# EAGLE design R_pi_pcb (EAGLE 6.6.0)
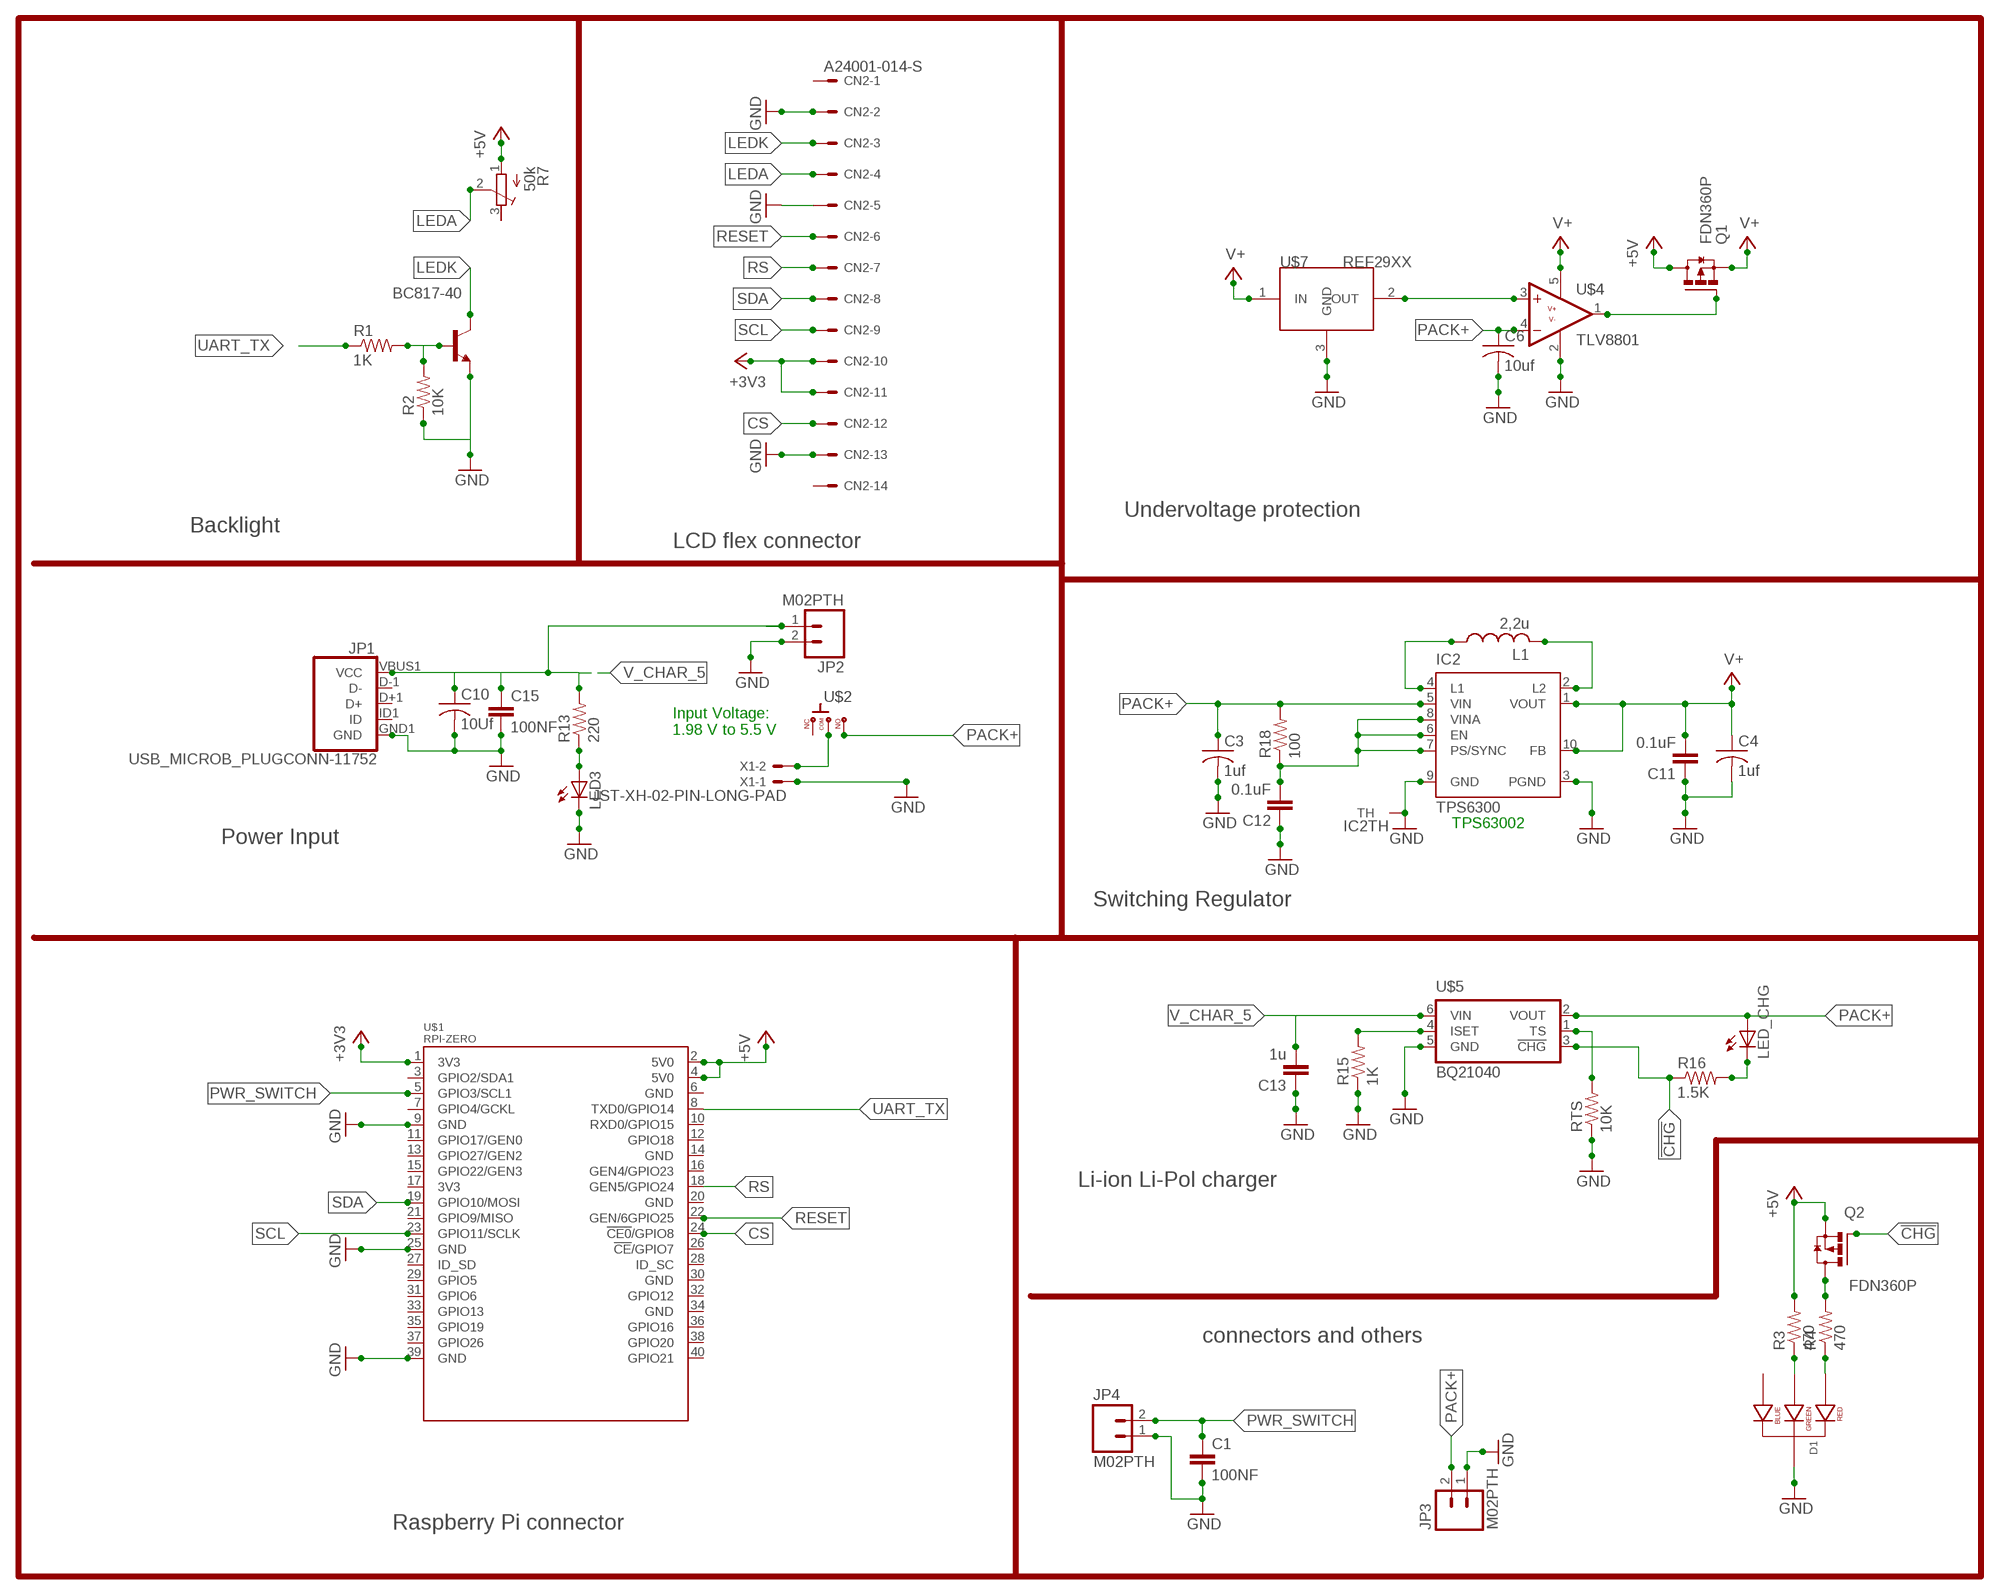
[diagram p0: schematic, sheet 1]

## Parts
BC817-40  BC817-40-NPN-SOT23-BEC  [SOT23-BEC]
C1  100NF  C-EUC0805  [C0805]
C3  1uf  C-USC1206K  [C1206K]
C4  1uf  C-USC1206K  [C1206K]
C6  10uf  C-USC1206K  [C1206K]
C10  10Uf  C-USC1206  [C1206]
C11  0.1uF  C-EUC0805  [C0805]
C12  0.1uF  C-EUC0805  [C0805]
C13  1u  C-EUC1206K  [C1206K]
C15  100NF  C-EUC0805  [C0805]
CN2  A24001-014-S  [A24001-014]
D1  LED-RGB-CC-THRUDIFFUSE  [LED-RGB-THRU]
IC2  TPS6300  [DRC-S-PVSON-N10]
JP1  USB_MICROB_PLUGCONN-11752  [USB-B-MICRO-SMD_V03]
JP2  M02PTH  [1X02]
JP3  M02PTH  [1X02]
JP4  M02PTH  [1X02]
L1  2,2u  L-USL1812  [L1812]
LED3  LEDCHIP-LED0805  [CHIP-LED0805]
LED_CHG  LEDCHIP-LED0805  [CHIP-LED0805]
Q1  FDN360P  [SUPER-SOT3]
Q2  FDN360P  [SUPER-SOT3]
R1  1K  R-US_R0805  [R0805]
R2  10K  R-US_R0805  [R0805]
R3  470  R-US_R0805  [R0805]
R4  470  R-US_R0805  [R0805]
R7  50k  R-TRIMM64P  [RTRIM64P]
R13  220  R-US_R0805  [R0805]
R15  1K  R-US_R0805  [R0805]
R16  1.5K  R-US_R0805  [R0805]
R18  100  R-US_R0805  [R0805]
RTS  10K  R-US_R0805  [R0805]
U$1  RPI-ZERO  [RASPBERRYPI_BASTELSTUBE_V13_RASPI_BOARD_B+_FULL]
U$2  -SWITCH  [CON3]
U$4  TLV8801  [SOT23-5]
U$5  BQ21040  [SOT23-6]
U$7  REF29XX  [SOT23]
X1  JST-XH-02-PIN-LONG-PAD  [JST-XH-02-PACKAGE-LONG-PAD]

## Nets
!CHG: Q2.1(G) R16.1 U$5.3(!CHG)
+3V3: CN2.10 CN2.11 U$1.1(3V3)
+5V: Q1.3(D) Q2.2(S) R3.2 R7.1(A) U$1.2(5V0) U$1.4(5V0)
CS: CN2.12 U$1.24(!CE0!/GPIO8)
GND: BC817-40.E C1.2 C3.2 C4.2 C6.2 C10.2 C11.1 C12.1 C13.1 C15.2 CN2.2 CN2.5 CN2.13 D1.2(CATHODE) IC2.3(PGND) IC2.9(GND) IC2.TH JP1.GND1(GND) JP2.2 JP3.1 JP4.1 LED3.C R2.1 R15.1 RTS.1 U$1.9(GND) U$1.25(GND) U$1.39(GND) U$4.2(V-) U$5.5(GND) U$7.3(GND) X1.1
LEDA: CN2.4 R7.2(S)
LEDK: BC817-40.C CN2.3
N$1: U$2.P$2 X1.2
N$3: U$4.3(+IN) U$7.2(OUT)
N$4: C12.2 IC2.6(EN) IC2.7(PS/SYNC) IC2.8(VINA) R18.1
N$5: Q1.1(G) U$4.1(OUT)
N$6: D1.3(GREEN_CATHODE) R3.1
N$7: BC817-40.B R1.2 R2.2
N$8: D1.1(RED_CATHODE) R4.1
N$10: Q2.3(D) R4.2
N$14: IC2.4(L1) L1.1
N$19: LED3.A R13.1
N$20: IC2.2(L2) L1.2
N$24: R15.2 U$5.4(ISET)
N$25: RTS.2 U$5.1(TS)
N$27: LED_CHG.C R16.2
PACK+: C3.1 C6.1 IC2.5(VIN) JP3.2 LED_CHG.A R18.2 U$2.P$3 U$4.4(-IN) U$5.2(VOUT)
PWR_SWITCH: C1.1 JP4.2 U$1.5(GPIO3/SCL1)
RESET: CN2.6 U$1.22(GEN/6GPIO25)
RS: CN2.7 U$1.18(GEN5/GPIO24)
SCL: CN2.9 U$1.23(GPIO11/SCLK)
SDA: CN2.8 U$1.19(GPIO10/MOSI)
UART_TX: R1.1 U$1.8(TXD0/GPIO14)
V+: C4.1 C11.2 IC2.1(VOUT) IC2.10(FB) Q1.2(S) U$4.5(V+) U$7.1(IN)
V_CHAR_5: C10.1 C13.2 C15.1 JP1.VBUS1(VCC) JP2.1 R13.2 U$5.6(VIN)
Unconnected: CN2.1 CN2.14 D1.4(BLUE_CATHODE) JP1.D+1(D+) JP1.D-1(D-) JP1.ID1(ID) R7.3(E) U$1.3(GPIO2/SDA1) U$1.6(GND) U$1.7(GPIO4/GCKL) U$1.10(RXD0/GPIO15) U$1.11(GPIO17/GEN0) U$1.12(GPIO18) U$1.13(GPIO27/GEN2) U$1.14(GND) U$1.15(GPIO22/GEN3) U$1.16(GEN4/GPIO23) U$1.17(3V3) U$1.20(GND) U$1.21(GPIO9/MISO) U$1.26(!CE!/GPIO7) U$1.27(ID_SD) U$1.28(ID_SC) U$1.29(GPIO5) U$1.30(GND) U$1.31(GPIO6) U$1.32(GPIO12) U$1.33(GPIO13) U$1.34(GND) U$1.35(GPIO19) U$1.36(GPIO16) U$1.37(GPIO26) U$1.38(GPIO20) U$1.40(GPIO21) U$2.P$1

## Notes on the sheet
- Undervoltage protection
- Backlight
- LCD flex connector
- Input Voltage:
  1.98 V to 5.5 V
- TPS63002
- Power Input
- Switching Regulator
- Li-ion Li-Pol charger
- connectors and others
- Raspberry Pi connector

## Library data of the parts
BC817-40 = transistor:*-NPN-: NPN Transistror BF959 corrected 2008.03.06
C1 C11-C13 C15 = rcl:C-EU: CAPACITOR, European symbol
C3 C4 C6 C10 = rcl:C-US: CAPACITOR, American symbol
CN2 = con-omnetics:A24001-014-S: CONNECTOR wire to board 1.27 mm (0.05") pitch header
D1 = SparkFun-LED:LED-RGB-CC-THRU: RGB Through-hole common cathode LED SparkFun Storefront: COM-00105 (Clear) COM-09264 (Diffuse); PROD_ID: DIO-09434
IC2 = texas_1:TPS6300*: HIGH EFFICIENT SINGLE INDUCTOR BUCK-BOOST CONVERTER WITH 1.8-A SWITCHES Source: http://focus.ti.com/lit/ds/symlink/tps63001.pdf; MPN: TPS63000DRCTG4; OC_FARNELL: 1511852; OC_NEWARK: 59M7217
JP1 = SparkFun-Connectors:USB_MICROB_PLUG: USB Micro-B Plug Comes in a variety of packages. Check out Hirose's ZX-x0 line: http://www.hirose.co.jp/cataloge_hp/e24200011.pdf; PROD_ID: CONN-11752
JP2-JP4 = SparkFun-Connectors:M02: Standard 2-pin 0.1" header. Use with - straight break away headers ( PRT-00116) - right angle break away headers (PRT-00553) - swiss pins (PRT-00743) - machine pins (PRT-00117) - female headers (PRT-00115) Molex polarized connector foot print use with: PRT-08233 with associated crimp pins and housings. 2.54_SCREWTERM for use with PRT-10571. 3.5mm Screw Terminal footprints for PRT-08084 5mm Screw Terminal footprints for use with PRT-08433
L1 = rcl:L-US: INDUCTOR, American symbol
LED3 LED_CHG = led:LED: LED OSRAM: - CHIPLED LG R971, LG N971, LY N971, LG Q971, LY Q971, LO R971, LY R971 LH N974, LH R974 LS Q976, LO Q976, LY Q976 LO Q996 - Hyper CHIPLED LW Q18S LB Q993, LB Q99A, LB R99A - SideLED LS A670, LO A670, LY A670, LG A670, LP A670 LB A673, LV A673, LT A673, LW A673 LH A674 LY A675 LS A676, LA A676, LO A676, LY A676, LW A676 LS A679, LY A679, LG A679 - Hyper Micro SIDELED® LS Y876, LA Y876, LO Y876, LY Y876 LT Y87S - SmartLED LW L88C, LW L88S LB L89C, LB L89S, LG L890 LS L89K, LO L89K, LY L89K LS L896, LA L896, LO L896, LY L896 - TOPLED LS T670, LO T670, LY T670, LG T670, LP T670 LSG T670, LSP T670, LSY T670, LOP T670, LYG T670 LG T671, LOG T671, LSG T671 LB T673, LV T673, LT T673, LW T673 LH T674 LS T676, LA T676, LO T676, LY T676, LB T676, LH T676, LSB T676, LW T676 LB T67C, LV T67C, LT T67C, LS T67K, LO T67K, LY T67K, LW E67C LS E67B, LA E67B, LO E67B, LY E67B, LB E67C, LV E67C, LT E67C LW T67C LS T679, LY T679, LG T679 LS T770, LO T770, LY T770, LG T770, LP T770 LB T773, LV T773, LT T773, LW T773 LH T774 LS E675, LA E675, LY E675, LS T675 LS T776, LA T776, LO T776, LY T776, LB T776 LHGB T686 LT T68C, LB T68C - Hyper Mini TOPLED® LB M676 - Mini TOPLED Santana® LG M470 LS M47K, LO M47K, LY M47K Source: http://www.osram.convergy.de LUXEON: - LUMILED® LXK2-PW12-R00, LXK2-PW12-S00, LXK2-PW14-U00, LXK2-PW14-V00 LXK2-PM12-R00, LXK2-PM12-S00, LXK2-PM14-U00 LXK2-PE12-Q00, LXK2-PE12-R00, LXK2-PE12-S00, LXK2-PE14-T00, LXK2-PE14-U00 LXK2-PB12-K00, LXK2-PB12-L00, LXK2-PB12-M00, LXK2-PB14-N00, LXK2-PB14-P00, LXK2-PB14-Q00 LXK2-PR12-L00, LXK2-PR12-M00, LXK2-PR14-Q00, LXK2-PR14-R00 LXK2-PD12-Q00, LXK2-PD12-R00, LXK2-PD12-S00 LXK2-PH12-R00, LXK2-PH12-S00 LXK2-PL12-P00, LXK2-PL12-Q00, LXK2-PL12-R00 Source: www.luxeon.com KINGBRIGHT: KA-3528ASYC Source: www.kingbright.com
Q1 Q2 = transistor-power:FDN360P: Single P-Channel, PowerTrench (R) MOSFET Source: http://www.fairchildsemi.com/ds/FD/FDN360P.pdf
R1-R4 R13 R15 R16 R18 RTS = rcl:R-US_: RESISTOR, American symbol
R7 = rcl:R-TRIMM: Trimm resistor
U$1 = RPI-Zero:RPI-ZERO
U$2 = tango:-SWITCH
U$4 = texas:TLV8801
U$5 = texas:BQ21040
U$7 = texas:REF29XX
X1 = con-Rembrandt Electronics - JST XH:JST-XH-02-PIN: JST XH Connector 2 Pin Wire to board connector. Pitch: 2,54 mm, (0.100") Number of pins: 2 Created by Rembrandt Electronics www.rembrandtelectronics.com

## Board
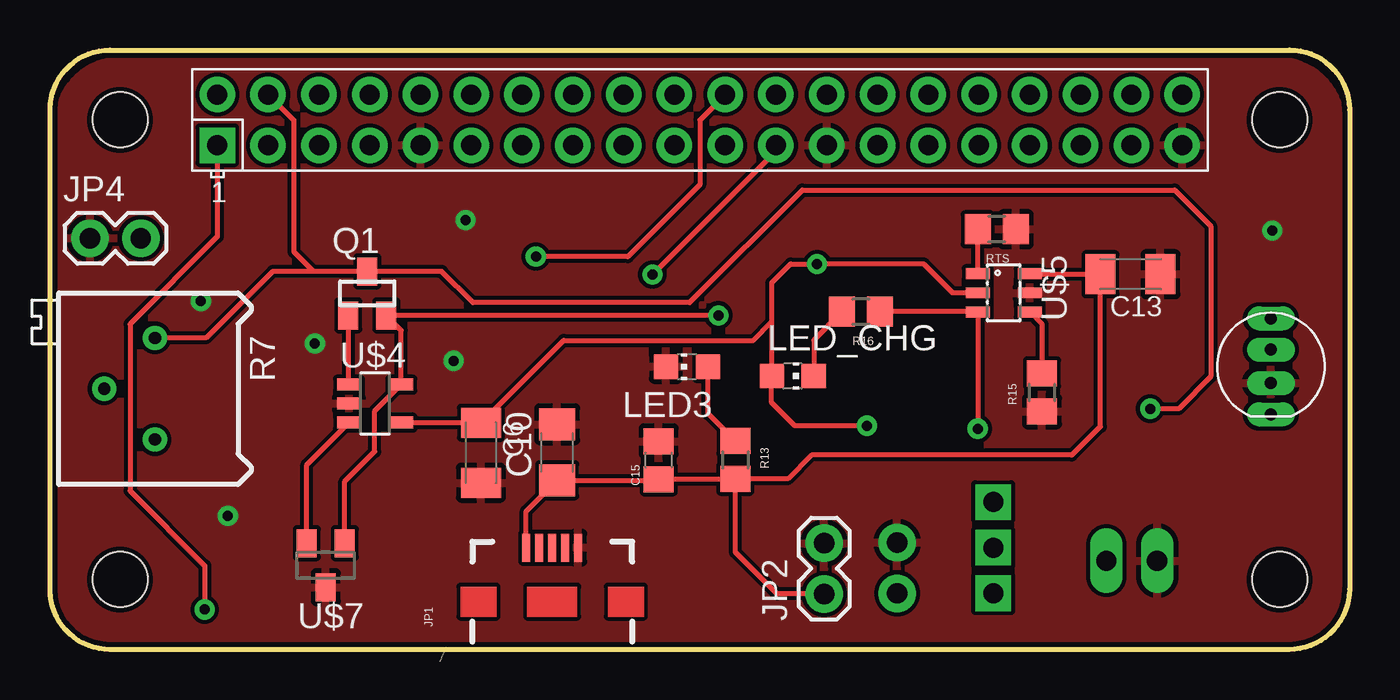
[diagram p1: board, top side]
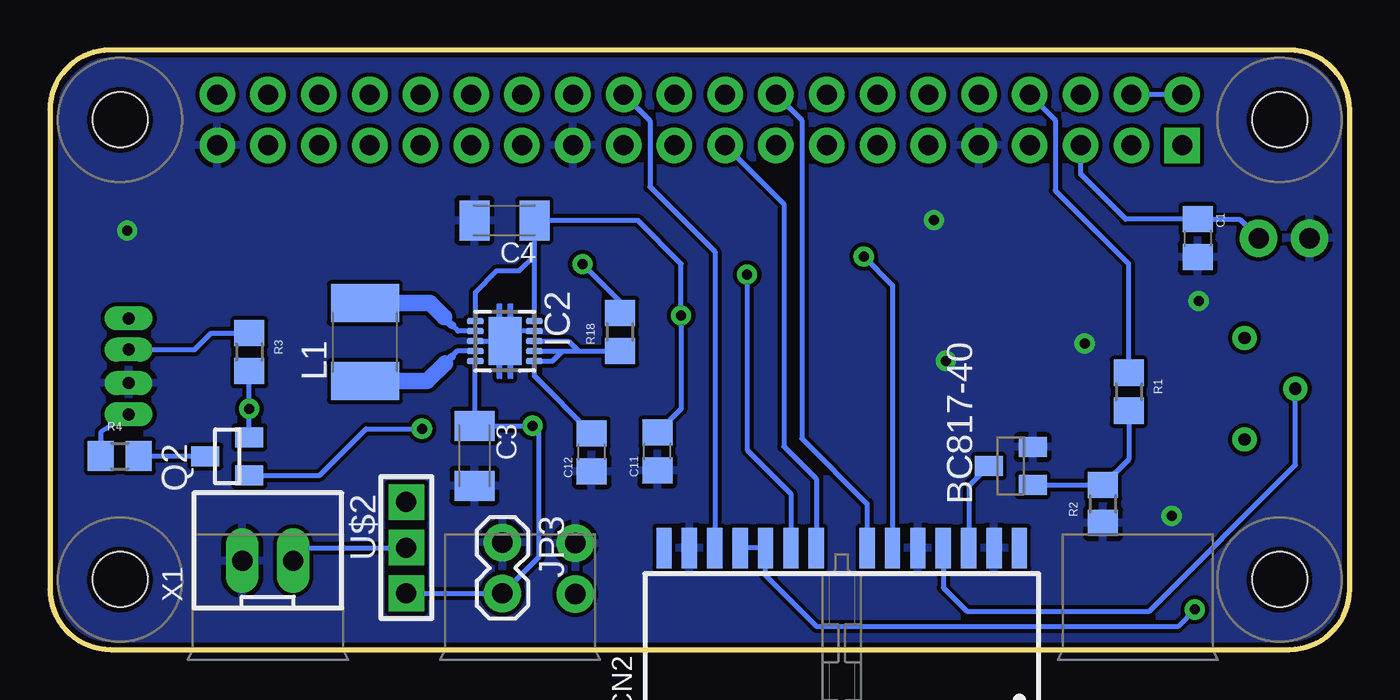
[diagram p2: board, bottom side, seen from below]

Size 65 x 30 mm. Coordinates in mm from the lower left corner, seen from the top.
Outline: 0,26.88 0,26.92 0,27.01 arc-90 2.99,30 62.01,30 arc-90 65,27.01 65,3.03 arc-90 61.97,0 3,0 arc-90 0,3 0,3.33 0,3.35 0,26.88
Copper layers (1*16): Top 0.035mm / dielectric 1.5mm / Bottom 0.035mm
Design rules "SparkFun": minimum track width 8mil, minimum drill 20mil, track to track 8mil, track to pad 8mil, pad to pad 8mil, via to via 8mil, smd to smd 8mil, copper to edge 10mil, drill to drill 8mil, minimum pad ring 12mil, minimum via ring 10mil, stop-mask expansion 4mil, vias tented up to drill 25mil, thermal gap 10mil

### Footprints (pad centres in the part's own frame; a part is rotated, then mirrored left to right if it is on the bottom)
SOT23-BEC = smd 1 x 1.4: B -0.95,-1.1; C 0,1.1; E 0.95,-1.1
C0805 = smd 1.3 x 1.5: 1 -0.95,0; 2 0.95,0
C1206K = smd 1.5 x 2: 1 -1.5,0; 2 1.5,0
C1206 = smd 1.6 x 1.8: 1 -1.4,0; 2 1.4,0
A24001-014 = smd 0.762 x 2.032: 1 8.89,5.08; 2 7.62,5.08; 3 6.35,5.08; 4 5.08,5.08; 5 3.81,5.08; 6 2.54,5.08; 7 1.27,5.08; 8 -1.27,5.08; 9 -2.54,5.08; 10 -3.81,5.08; 11 -5.08,5.08; 12 -6.35,5.08; 13 -7.62,5.08; 14 -8.89,5.08
LED-RGB-THRU = drill 0.6 pad 0.813 long: 1 2.405,0; 2 0.835,0; 3 -0.835,0; 4 -2.405,0
DRC-S-PVSON-N10 = smd 0.28 x 0.85: 1 -1,-1.475; 2 -0.5,-1.475; 3 0,-1.475; 4 0.5,-1.475; 5 1,-1.475; 6 1,1.475; 7 0.5,1.475; 8 0,1.475; 9 -0.5,1.475; 10 -1,1.475 | smd 2.4 x 1.65: TH 0,0
USB-B-MICRO-SMD_V03 = smd 1.4 x 0.4: D+1 2.7,0; D-1 2.7,0.65; GND1 2.7,-1.3; ID1 2.7,-0.65; VBUS1 2.7,1.3
1X02 = drill 1.016 pad 1.88: 1 0,0; 2 2.54,0
L1812 = smd 1.9 x 3.4: 1 -1.95,0; 2 1.95,0
CHIP-LED0805 = smd 1.2 x 1.2: A 0,-1.05; C 0,1.05
SUPER-SOT3 = smd 1 x 1.4: 1 -0.95,-1.1; 2 0.95,-1.1; 3 0,1.1
R0805 = smd 1.3 x 1.5: 1 -0.95,0; 2 0.95,0
RTRIM64P = drill 0.61: 1 0,-2.54; 2 2.54,0; 3 0,2.54
RASPBERRYPI_BASTELSTUBE_V13_RASPI_BOARD_B+_FULL = drill 1 pad 1.778 square: 1 8.37,25.23 | drill 1 pad 1.778: 2 8.37,27.77; 3 10.91,25.23; 4 10.91,27.77; 5 13.45,25.23; 6 13.45,27.77; 7 15.99,25.23; 8 15.99,27.77; 9 18.53,25.23; 10 18.53,27.77; 11 21.07,25.23; 12 21.07,27.77; 13 23.61,25.23; 14 23.61,27.77; 15 26.15,25.23; 16 26.15,27.77; 17 28.69,25.23; 18 28.69,27.77; 19 31.23,25.23; 20 31.23,27.77; 21 33.77,25.23; 22 33.77,27.77; 23 36.31,25.23; 24 36.31,27.77; 25 38.85,25.23; 26 38.85,27.77; 27 41.39,25.23; 28 41.39,27.77; 29 43.93,25.23; 30 43.93,27.77; 31 46.47,25.23; 32 46.47,27.77; 33 49.01,25.23; 34 49.01,27.77; 35 51.55,25.23; 36 51.55,27.77; 37 54.09,25.23; 38 54.09,27.77; 39 56.63,25.23; 40 56.63,27.77 | hole 2.75: 3.5,3.5; 3.5,26.5; 61.5,3.5; 61.5,26.5
CON3 = drill 1 pad 1.778 square: P$1 -2.794,0.254; P$2 -0.508,0.254; P$3 1.778,0.254
SOT23-5 = smd 0.6 x 1.2: 1 -0.95,-1.306; 2 0,-1.306; 3 0.95,-1.306; 4 0.95,1.306; 5 -0.95,1.306
SOT23-6 = smd 0.55 x 1.2: 1 -0.95,-1.3; 2 0,-1.3; 3 0.95,-1.3; 4 0.95,1.3; 5 0,1.3; 6 -0.95,1.3
SOT23 = smd 1 x 1.4: 1 -0.95,-1.1; 2 0.95,-1.1; 3 0,1.1
JST-XH-02-PACKAGE-LONG-PAD = drill 1.016 long: 1 -1.27,0; 2 1.27,0

### Placement (x,y rotation side)
BC817-40  16.95,9.18 90 bottom
C1  7.6,20.58 270 bottom
C3  43.77,9.7 270 bottom
C4  42.27,21.47 180 bottom
C6  21.56,9.84 270 top
C10  25.37,9.87 90 top
C11  34.62,9.91 90 bottom
C12  37.91,9.87 90 bottom
C13  54.04,18.78 180 top
C15  30.45,9.47 90 top
CN2  25.4,0 0 bottom
D1  61.07,14.17 270 top
IC2  42.25,15.43 270 bottom
JP1  25.12,2.4 90 top
JP2  38.72,2.78 90 top
JP3  42.37,5.35 270 bottom
JP4  2,20.58 0 top
L1  49.24,15.38 90 bottom
LED3  31.86,14.15 90 top
LED_CHG  37.15,13.68 270 top
Q1  15.87,17.82 0 top
Q2  56.13,9.67 90 bottom
R1  11.04,12.9 270 bottom
R2  12.33,7.28 90 bottom
R3  55.03,14.88 270 bottom
R4  61.51,9.68 0 bottom
R7  5.25,13.05 180 top
R13  34.28,9.49 270 top
R15  49.62,12.87 90 top
R16  40.57,16.9 180 top
R18  36.48,15.89 90 bottom
RTS  47.35,21.03 180 top
U$1  0,0 0 top
U$2  47.43,4.59 270 bottom
U$4  16.26,12.31 270 top
U$5  47.7,17.85 270 top
U$7  13.79,4.22 180 top
X1  54.11,4.44 0 bottom

### Tracks (layer width: path | path; a pad name or v marks a point on that pad's centre or on a via)
!CHG  (via drill 0.5 pad 0.41)
  Top 0.254: v46.4,11.05 U$5.3 R16.1
  Bottom 0.254: Q2.1 51.51,8.72 49.18,11.05 v46.4,11.05
+3V3  (via drill 0.5 pad 0.81)
  Top 0.254: U$1.1 8.37,20.65 4,16.28 4,7.94 7.74,4.2 v7.74,2
  Bottom 0.254: v7.74,2 8.59,1.15 26.64,1.15 29.21,3.72 CN2.10 CN2.11
+5V  (via drill 0.5 pad 0.41)
  Top 0.254: R7.1 7.81,15.59 11.14,18.92 13.18,18.92 | U$1.4 12.19,26.49 12.19,19.91 13.18,18.92 | 13.18,18.92 Q1.3 19.6,18.92 21.16,17.36 31.99,17.36 37.63,23 56.25,23 58.06,21.19 58.06,13.66 56.45,12.05 v55.03,12.05
  Bottom 0.254: U$1.2 U$1.4 | Q2.2 v55.03,12.05 R3.2
CS
  Bottom 0.254: U$1.24 35,26.46 35,23.16 31.75,19.91 CN2.12
GND  (via drill 0.5 pad 0.41)
  Bottom 0.254: IC2.9 41.75,15.93 IC2.TH IC2.3
  other vias: 20.18,14.45 7.55,17.43 8.9,6.68 20.78,21.49 61.13,20.97 13.25,15.32
  pour Bottom: 0.4,14.56 0.4,26.36 arc-90 3.6,29.56 61.5,29.56 arc-90 64.6,26.46 64.6,3.46 arc-90 61.5,0.36 61.4,0.36 3.3,0.36 arc-90 0.4,3.26 0.4,3.66
  pour Top: 64.6,3.16 64.6,26.26 arc90 61.4,29.46 3.5,29.46 arc90 0.4,26.36 0.4,3.36 arc90 3.5,0.26 61.7,0.26 arc90
LEDA
  Bottom 0.254: CN2.4 20.32,3.09 19.15,1.92 10.02,1.92 2.71,9.23 R7.2
LEDK
  Bottom 0.254: BC817-40.C 19.05,8.18 CN2.3
N$1
  Bottom 0.254: X1.2 52.18,5.1 U$2.P$2
N$3
  Top 0.254: U$7.2 12.84,9.25 U$4.3
N$4
  Bottom 0.254: IC2.7 39.37,14.93 | 39.37,14.93 38.57,14.93 | 38.57,14.93 R18.1 | 39.37,14.93 39.87,14.43 IC2.6 40.77,13.68 C12.2 | IC2.8 39.07,15.43 38.57,14.93
N$5
  Top 0.254: Q1.1 14.92,13.29 U$4.1
N$6
  Bottom 0.254: R3.1 56.93,15.83 57.75,15 D1.3
N$7
  Bottom 0.254: BC817-40.B R2.2 11.04,9.52 R1.2
N$8
  Bottom 0.254: D1.1 62.46,10.88 R4.1
N$10
  Bottom 0.254: R4.2 Q2.3
N$14
  Bottom 0.254: IC2.4 44.64,14.93 44.91,14.66
  Bottom 0.406: 44.91,14.66 45.25,14.32
  Bottom 0.813: 45.25,14.32 46.14,13.43 L1.1
N$19
  Top 0.254: R13.1 32.91,11.81 LED3.A
N$20
  Bottom 0.254: IC2.2 44.59,15.93 44.88,16.22
  Bottom 0.406: 44.88,16.22 45.29,16.63
  Bottom 0.813: 45.29,16.63 45.99,17.33 L1.2
N$24
  Top 0.254: U$5.4 49.62,16.28 R15.2
N$25
  Top 0.254: U$5.1 RTS.2
N$27
  Top 0.254: R16.2 38.2,15.48 LED_CHG.C
PACK+  (via drill 0.5 pad 0.41, 0.5 pad 0.81)
  Top 0.254: U$4.4 21.54,11.36 C6.1 25.69,15.47 35.18,15.47 36.1,16.39 | U$5.2 45.15,17.85 43.71,19.29 v38.37,19.29 37.04,19.29 36.1,18.35 36.1,16.39 | v40.87,11.2 37.25,11.2 36.1,12.35 LED_CHG.A 36.1,16.39
  Bottom 0.254: IC2.5 43.77,14.38 C3.1 v40.87,11.2 40.55,10.88 40.55,4.63 JP3.2 U$2.P$3 | v38.37,19.29 36.48,17.4 R18.2
PWR_SWITCH
  Bottom 0.254: U$1.5 13.45,23.78 11.2,21.53 C1.1 5.49,21.53 JP4.2
RESET  (via drill 0.5 pad 0.81)
  Top 0.254: U$1.22 32.5,26.5 32.5,23.26 28.9,19.66 v24.3,19.66
  Bottom 0.254: v24.3,19.66 22.86,18.22 CN2.6
RS
  Bottom 0.254: U$1.18 27.4,26.48 27.4,10.56 24.13,7.29 CN2.7
SCL  (via drill 0.5 pad 0.81)
  Top 0.254: U$1.23 36.31,24.94 v30.13,18.76
  Bottom 0.254: CN2.9 27.94,7.8 30.13,9.99 v30.13,18.76
SDA
  Bottom 0.254: U$1.19 28.3,22.3 28.3,10.16 26.67,8.53 CN2.8
UART_TX
  Bottom 0.254: U$1.8 14.72,26.5 14.72,22.97 11.04,19.29 R1.1
V+  (via drill 0.5 pad 0.81)
  Top 0.254: U$7.1 14.74,8.41 16.24,9.91 16.24,11.93 U$4.5 17.57,15.97 Q1.2 v33.43,16.72
  Bottom 0.254: IC2.10 40.77,19.71 | 40.77,19.71 C4.1 35.6,21.47 33.43,19.3 v33.43,16.72 33.43,12.05 C11.2 | IC2.1 43.72,17.87 42.65,18.95 41.53,18.95 40.77,19.71
V_CHAR_5
  Top 0.254: JP1.VBUS1 23.82,6.92 C10.1 30.4,8.47 C15.1 30.47,8.54 R13.2 | JP2.1 36.37,2.78 34.28,4.87 R13.2 | U$5.6 C13.2 52.54,11.16 51.11,9.73 38.09,9.73 36.9,8.54 R13.2